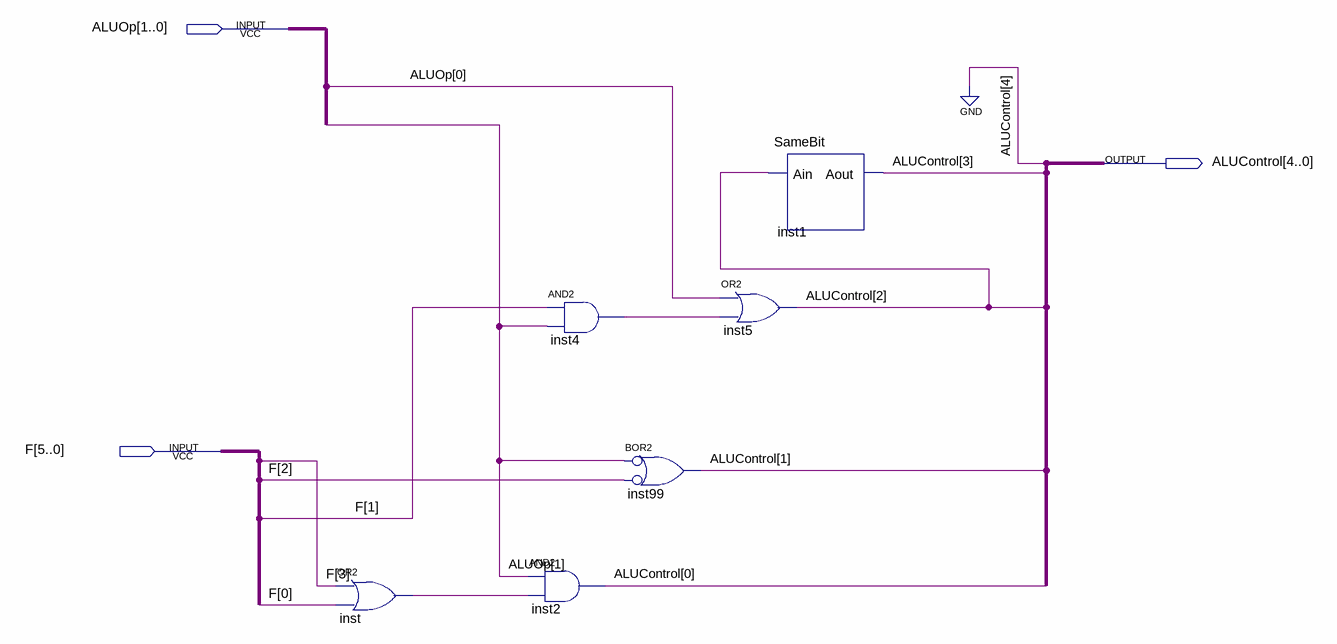
[diagram p0: schematic sheet]
// Quartus schematic ALUCtl.bdf as structural Verilog: 6 symbols, 3 pins
module ALUCtl (
  input  [1:0] ALUOp,
  input  [5:0] F,
  output [4:0] ALUControl
);

  wire inst4_out, inst_out;

  or inst (inst_out, F[3], F[0]);
  and inst4 (inst4_out, F[1], ALUOp[1]);
  and inst2 (ALUControl[0], ALUOp[1], inst_out);
  or inst99 (ALUControl[1], ~ALUOp[1], ~F[2]);  // BOR2
  or inst5 (ALUControl[2], ALUOp[0], inst4_out);
  SameBit inst1 (.Ain(ALUControl[2]), .Aout(ALUControl[3]));

  assign ALUControl[4] = 1'b0;
endmodule
